# EAGLE design sematik (EAGLE 9.6.2)
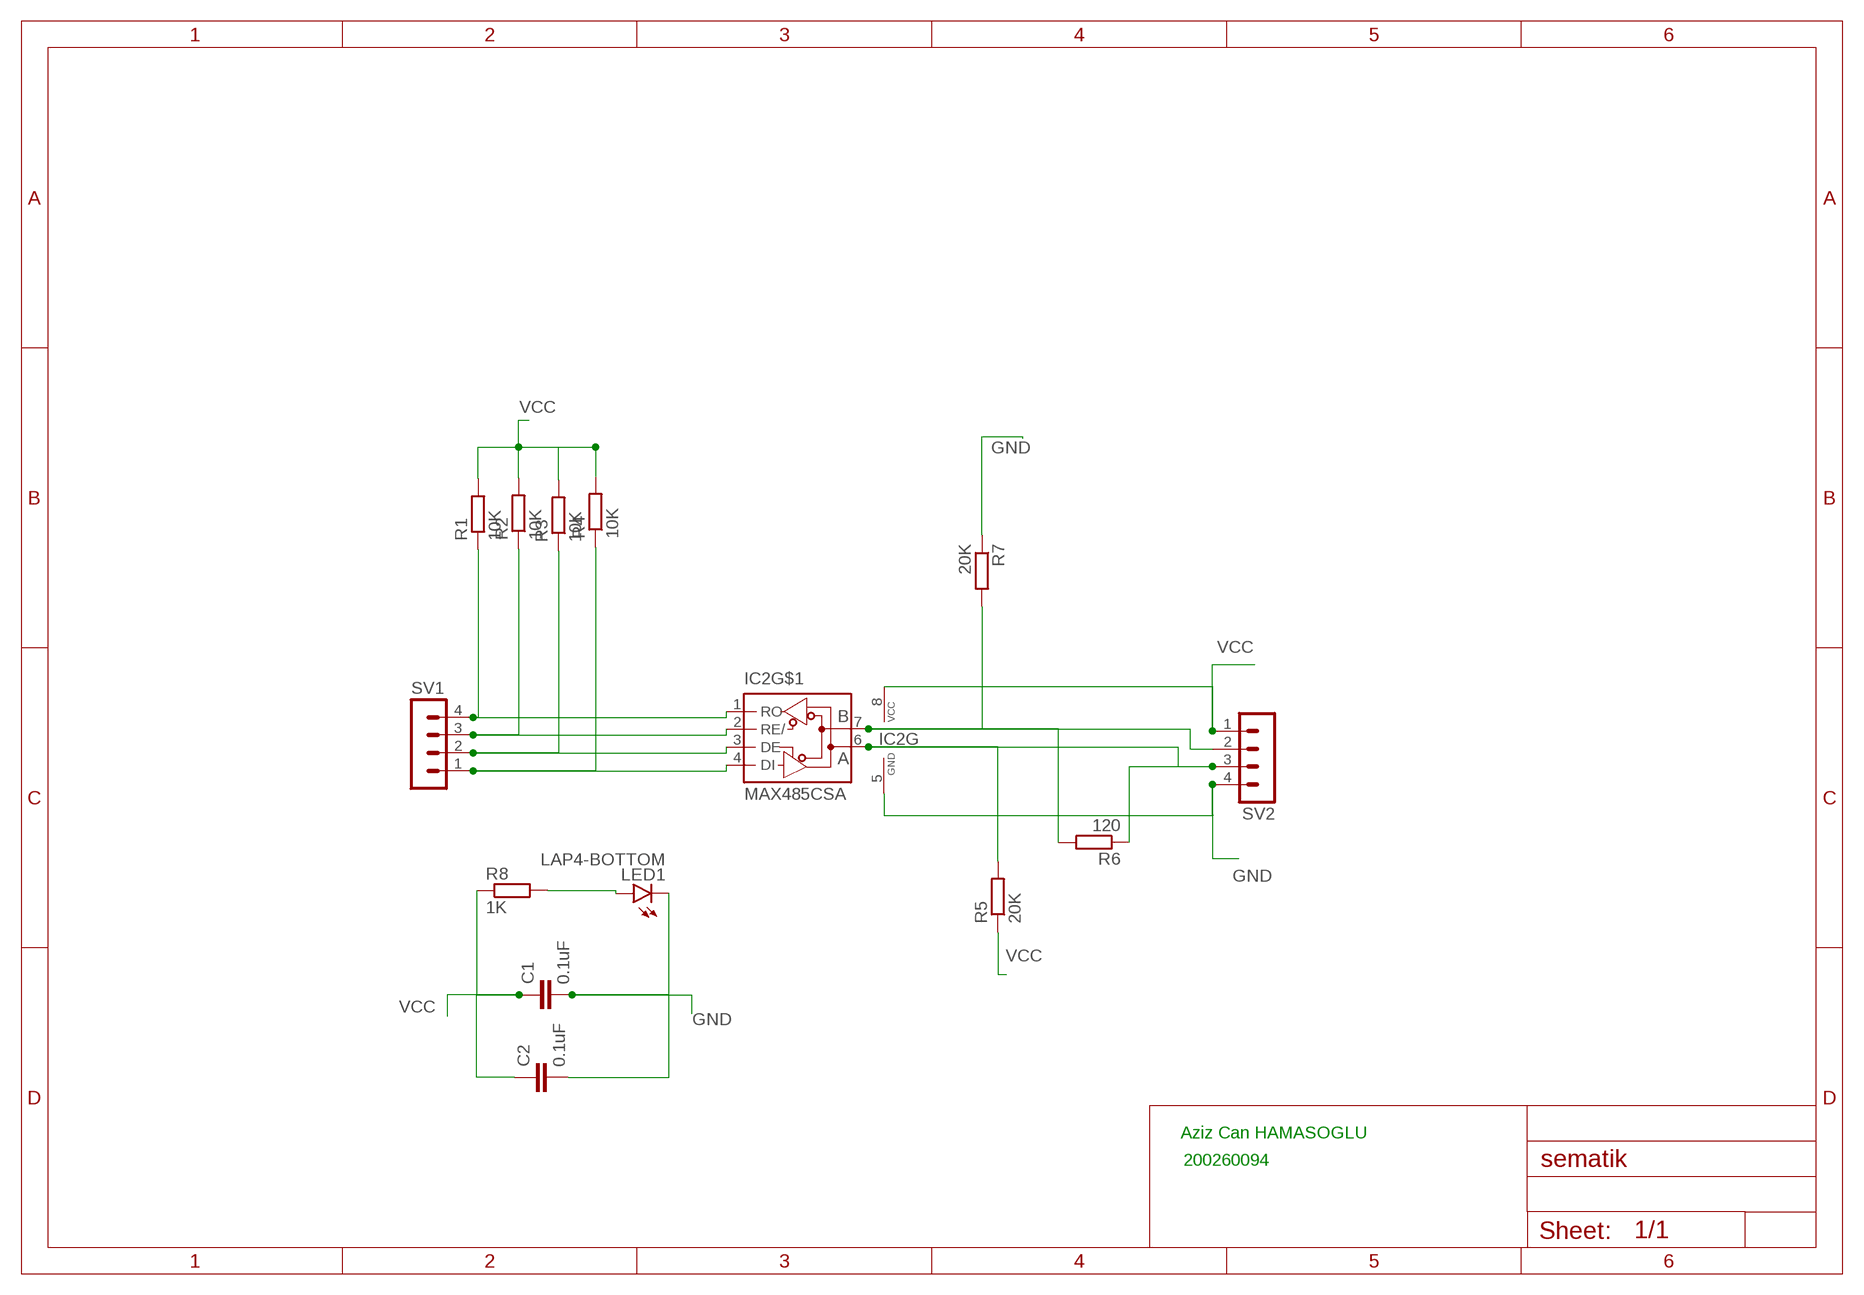
[diagram p0: schematic, sheet 1]

## Parts
C1  0.1uF  C-EUC0402K  [C0402K]
C2  0.1uF  C-EUC0402K  [C0402K]
IC2  MAX485CSA  [SO08]
LED1  LAP4-BOTTOM  [P47F-BOTTOM]
R1  10K  R-EU_M1206  [M1206]
R2  10K  R-EU_M1206  [M1206]
R3  10K  R-EU_M1206  [M1206]
R4  10K  R-EU_M1206  [M1206]
R5  20K  R-EU_M1206  [M1206]
R6  120  R-EU_M1206  [M1206]
R7  20K  R-EU_M1206  [M1206]
R8  1K  R-EU_M1206  [M1206]
SV1  MA04-1  [MA04-1]
SV2  MA04-1  [MA04-1]

## Nets
GND: C1.2 C2.2 IC2.5(G:GND) LED1.C R7.1 SV2.4
N$1: IC2.1(RO) R1.1 SV1.4
N$2: IC2.2(RE/) R2.1 SV1.3
N$3: IC2.3(DE) R3.1 SV1.2
N$4: IC2.4(DI) R4.1 SV1.1
N$7: IC2.7(B) R6.2 R7.2 SV2.2
N$8: IC2.6(A) R5.2 R6.1 SV2.3
N$11: LED1.A R8.2
VCC: C1.1 C2.1 IC2.8(G:VCC) R1.2 R2.2 R3.2 R4.2 R5.1 R8.1 SV2.1

## Notes on the sheet
- Aziz Can HAMASOGLU
- 200260094

## Library data of the parts
C1 C2 = rcl:C-EU: CAPACITOR, European symbol; SPICEPREFIX: C
IC2 = andereBauteile:MAX485: MAX485 RS485 Half Duplex Driver
LED1 = led:*P4: PointLED® Enhanced Thinfilm LED TOP & BOTTOM mount LS P47F, LR P47F, LA P47F, LY P47F, LT P4SG, LB P4SG, LW P4SG Source: http://catalog.osram-os.com .. LA_LR_LS_LY_P47F_Pb_free.pdf
R1-R8 = rcl:R-EU_: RESISTOR, European symbol; SPICEPREFIX: R
SV1 SV2 = con-lstb:MA04-1: PIN HEADER; OC_FARNELL: unknown; OC_NEWARK: unknown

## Board
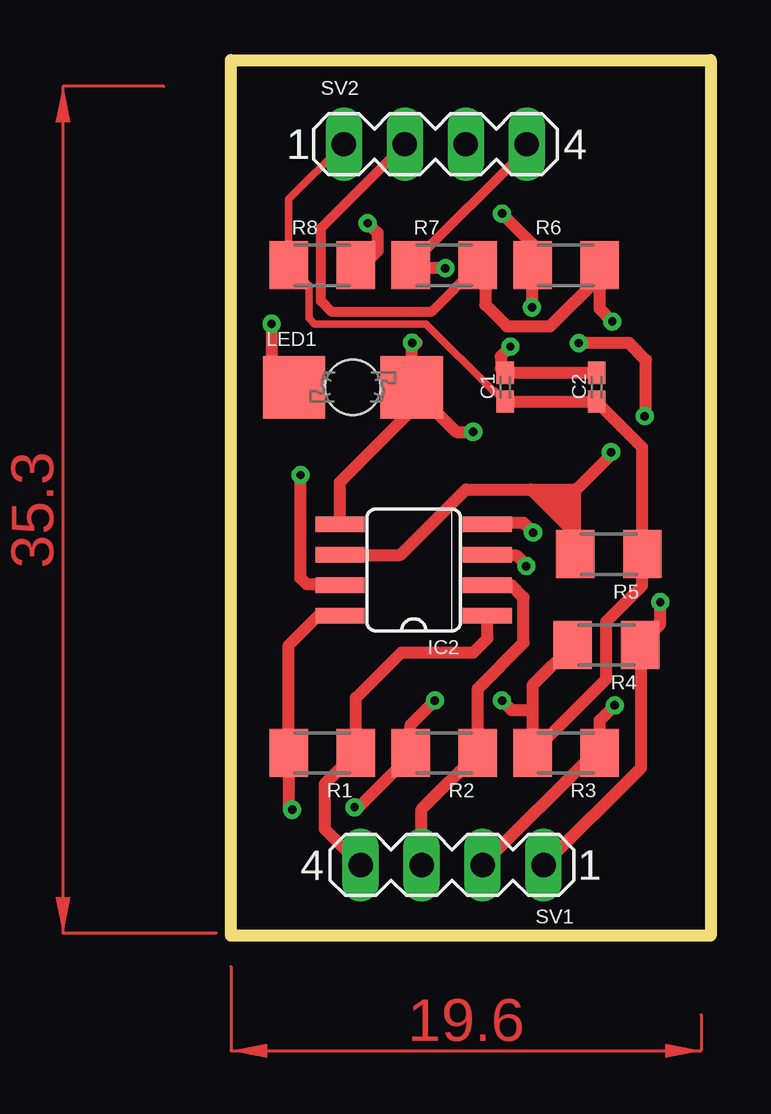
[diagram p1: board, top side]
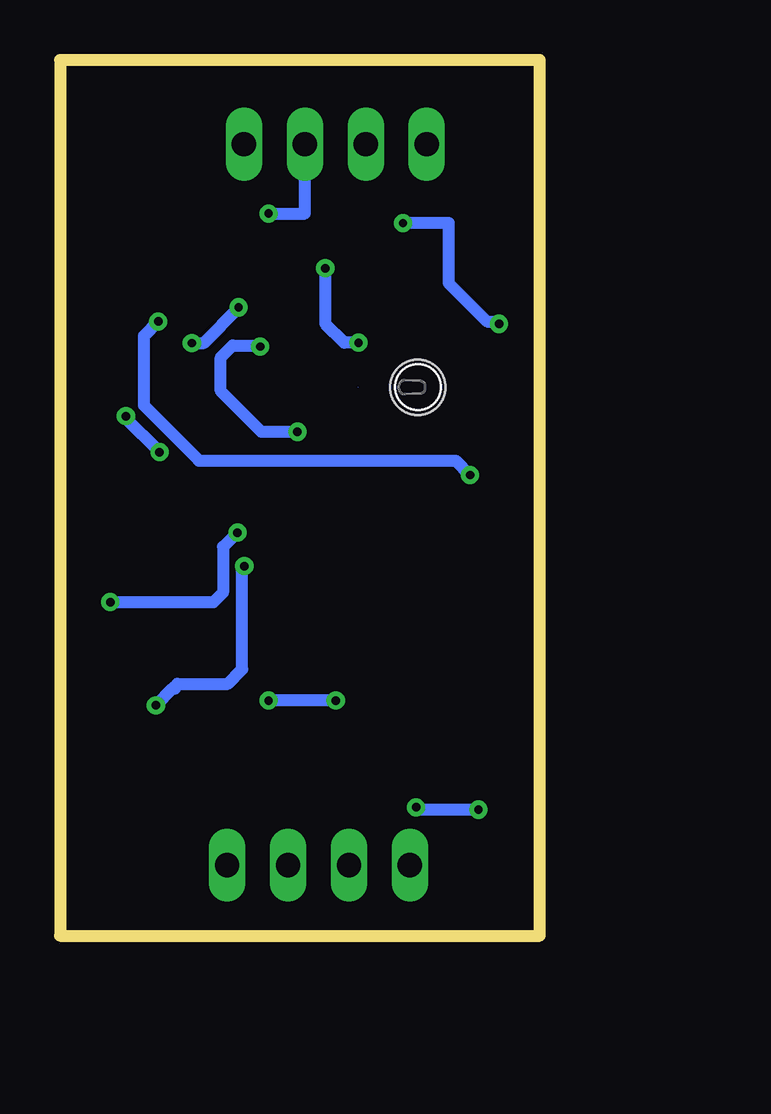
[diagram p2: board, bottom side, seen from below]

Size 20 x 36.5 mm. Coordinates in mm from the lower left corner, seen from the top.
Outline: 0,0 0,36.5 20,36.5 20,0 0,0
Copper layers (1*16): Top 0.035mm / dielectric 1.5mm / Bottom 0.035mm
Design rules "default": minimum track width 6mil, minimum drill 0.35mm, track to track 6mil, track to pad 6mil, pad to pad 6mil, via to via 6mil, smd to smd 6mil, copper to edge 40mil, drill to drill 6mil, minimum pad ring 10mil, minimum via ring 8mil, stop-mask expansion 4mil, vias tented up to drill 0mil, thermal gap 10mil

### Footprints (pad centres in the part's own frame; a part is rotated, then mirrored left to right if it is on the bottom)
C0402K = smd 0.925 x 0.74: 1 -0.6,0; 2 0.6,0
SO08 = smd 0.66 x 2.032: 1 -1.905,-3.073; 2 -0.635,-3.073; 3 0.635,-3.073; 4 1.905,-3.073; 5 1.905,3.073; 6 0.635,3.073; 7 -0.635,3.073; 8 -1.905,3.073
P47F-BOTTOM = smd 2.6 x 2.6: A -2.45,0; C 2.45,0 | hole 2.3: 0,0
M1206 = smd 1.6 x 2: 1 -1.4,0; 2 1.4,0
MA04-1 = drill 1.016 long: 1 -3.81,0; 2 -1.27,0; 3 1.27,0; 4 3.81,0

### Placement (x,y rotation side)
C1  11.43,22.86 90 top
C2  15.24,22.86 90 top
IC2  7.62,15.24 90 top
LED1  5.08,22.86 0 top
R1  3.81,7.62 180 top
R2  8.89,7.62 180 top
R3  13.97,7.62 180 top
R4  15.65,12.12 180 top
R5  15.75,15.9 180 top
R6  13.97,27.94 0 top
R7  8.89,27.94 0 top
R8  3.81,27.94 0 top
SV1  9.22,2.94 180 top
SV2  8.52,32.99 0 top

### Tracks (layer width: path | path; a pad name or v marks a point on that pad's centre or on a via)
GND  (via drill 0.35)
  Top 0.406: R7.1 12.33,32.78 SV2.4
  Top 0.508: C2.2 C1.2 11.25,23.64 11.25,24.15 v11.65,24.55 | 7.75,22.64 LED1.C 7.53,24.5 7.75,24.71 v7.55,24.71 | 7.75,22.64 9.39,21 v10.1,21 | 7.75,22.64 7.5,22.4 7.5,21.86 4.55,18.9 IC2.5 | v8.94,27.82 7.1,27.82 7.1,27.6 7.44,27.94 R7.1
  Bottom 0.508: v10.1,21 11.6,21 13.3,22.7 13.3,24.1 12.8,24.6 11.8,24.6 11.7,24.5 v11.65,24.55 | v8.94,27.82 8.94,25.52 8.14,24.71 v7.55,24.71
N$1
  Top 0.508: SV1.4 3.91,4.44 3.91,6.32 R1.1 5.21,9.91 7.1,11.8 10.1,11.8 10.69,12.39 IC2.1
N$2
  Top 0.508: SV1.3 7.95,5.28 R2.1 10.29,10.29 12.2,12.2 12.2,14.1 11.7,14.61 IC2.2
N$3  (via drill 0.35)
  Top 0.508: SV1.2 15.17,7.62 R3.1 15.37,8.97 v16,9.6 | v12.31,15.4 12.31,15.45 11.92,15.84 10.73,15.84 IC2.3
  Bottom 0.508: v16,9.6 15.3,10.3 | 15.3,10.3 15.2,10.3 | 15.3,10.3 15.1,10.5 13,10.5 12.4,11.1 12.4,15.31 v12.31,15.4
N$4  (via drill 0.35)
  Top 0.508: SV1.1 17.1,7.01 17.1,12.07 R4.1 17.9,12.97 v17.9,13.9 | v12.6,16.8 12.2,17.2 10.75,17.2 IC2.4
  Bottom 0.508: v17.9,13.9 13.6,13.9 13.2,14.3 13.2,16.2 v12.6,16.8
N$7  (via drill 0.35)
  Top 0.406: R7.2 8.35,26 4.2,26 3.75,26.45 3.75,29.49 SV2.2
  Top 0.508: 9.87,27.94 R7.2 10.6,27.63 10.6,26.3 11.5,25.4 13.3,25.4 15.37,27.47 R6.2 15.37,26.13 v15.9,25.6 | 7.25,32.26 SV2.2 | IC2.7 4.51,14.64 3.16,14.64 2.9,14.9 v2.9,19.2
  Bottom 0.508: v2.9,19.2 3.5,19.8 14.2,19.8 16.5,22.1 16.5,25 v15.9,25.6
N$8  (via drill 0.35)
  Top 0.508: v11.3,30.1 12.57,28.83 R6.1 12.57,26.2 v12.55,26.18 | IC2.6 7.08,15.88 9.8,18.6 12.5,18.6 | 12.5,18.6 12.75,18.35 | 12.75,18.35 12.95,18.15 | 12.95,18.15 13.5,17.6 | 13.5,17.6 14.35,16.75 R5.2 14.35,17.7 | 14.35,17.7 14.35,18 | 14.35,18 14.35,18.55 | 14.35,18.55 15.9,20.1 v15.85,20.15 | v17.25,21.65 17.3,21.7 17.3,24 16.6,24.7 v14.5,24.7 | 13.5,17.6 14.1,17.6 | 14.1,17.6 14.25,17.6 14.35,17.7 | 12.75,18.35 14,18.35 14.35,18 | 12.95,18.15 13.55,18.15 14.1,17.6 | 12.5,18.6 14.3,18.6 14.35,18.55
  Bottom 0.508: v11.3,30.1 9.79,30.1 SV2.3 | v15.85,20.15 17.3,21.6 v17.25,21.65 | v14.5,24.7 14,24.7 12.55,26.15 v12.55,26.18
N$11  (via drill 0.35)
  Top 0.508: LED1.A 1.69,23.8 v1.69,25.5 | v5.7,29.7 6.11,29.29 6.11,28.54 5.51,27.94 R8.2
  Bottom 0.508: v1.69,25.5 1.79,25.6 2.19,25.6 3.79,27.2 3.79,29.7 v5.7,29.7
VCC  (via drill 0.35)
  Top 0.305: C1.1 11,22.69 10.93,22.69 8.13,25.49 3.49,25.49 3.25,25.73 3.25,27.1 R8.1 2.41,30.69 SV2.1
  Top 0.508: C1.1 C2.1 17.15,20.35 R5.1 17.15,14.6 15.64,13.09 15.64,10.69 R3.2 12.57,9.4 | R4.2 12.57,10.44 12.57,9.4 | IC2.8 3.65,13.34 2.41,12.1 R1.2 2.41,5.29 2.5,5.2 v2.55,5.25 | v5.15,5.35 5.23,5.27 7.54,7.57 R2.2 7.49,8.79 v8.5,9.8 | v11.3,9.8 11.7,9.4 12.57,9.4
  Bottom 0.508: v2.55,5.25 5.15,5.25 5.2,5.3 v5.15,5.35 | v8.5,9.8 v11.3,9.8
(copper drawn outside any net)
  shapes: Top area x2